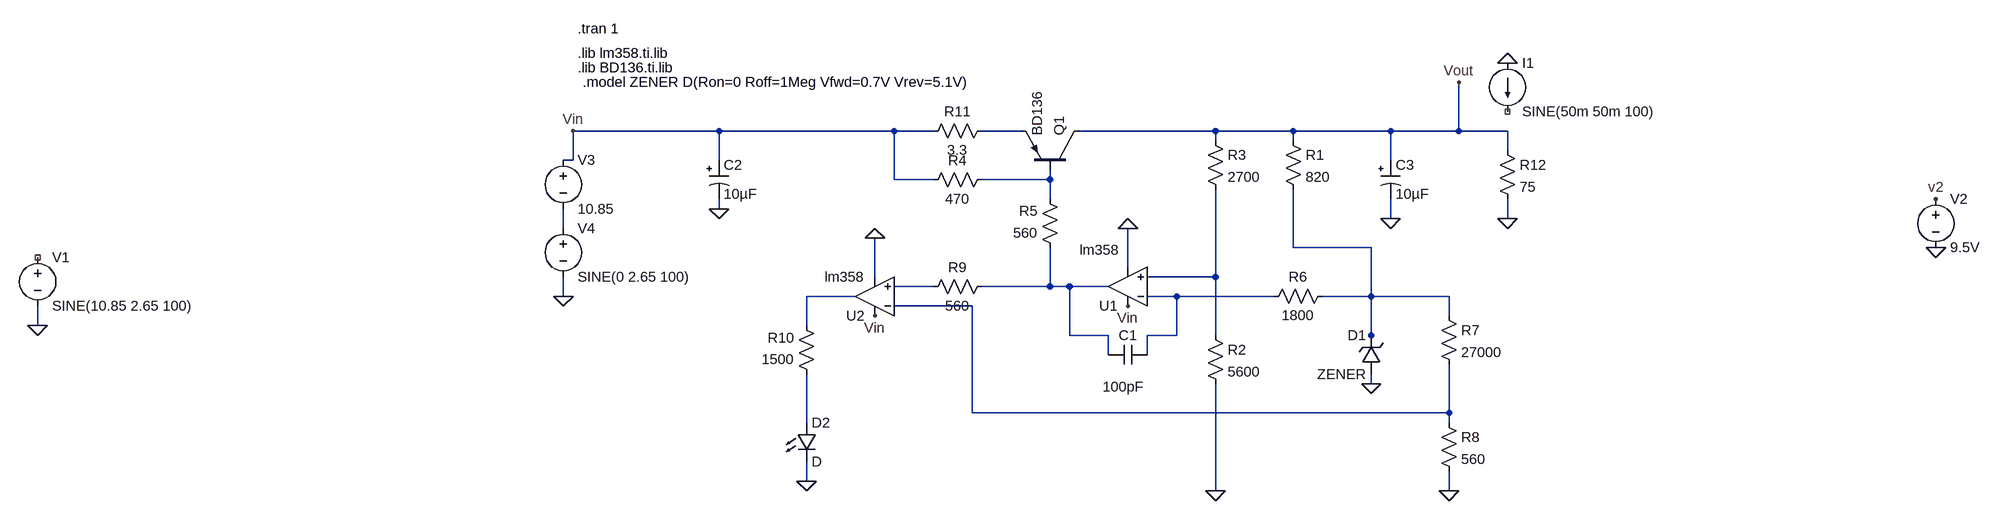
[diagram p0: schematic plab_1.asc]
plab_1.asc, the LTspice schematic file:
Version 4
SHEET 1 2036 896
WIRE -240 -208 -480 -208
WIRE 48 -208 -240 -208
WIRE 112 -208 48 -208
WIRE 256 -208 192 -208
WIRE 576 -208 352 -208
WIRE 704 -208 576 -208
WIRE 864 -208 704 -208
WIRE 976 -208 976 -288
WIRE 976 -208 864 -208
WIRE 1056 -208 976 -208
WIRE 576 -192 576 -208
WIRE 704 -192 704 -208
WIRE 1056 -176 1056 -208
WIRE -480 -160 -480 -208
WIRE -480 -160 -496 -160
WIRE -240 -160 -240 -208
WIRE 864 -160 864 -208
WIRE 48 -128 48 -208
WIRE 112 -128 48 -128
WIRE 304 -128 304 -144
WIRE 304 -128 192 -128
WIRE 304 -96 304 -128
WIRE -240 -80 -240 -96
WIRE 864 -64 864 -96
WIRE 1056 -64 1056 -96
WIRE -496 -48 -496 -80
WIRE 704 -16 704 -112
WIRE 832 -16 704 -16
WIRE 432 16 432 -48
WIRE 16 32 16 -32
WIRE 576 32 576 -112
WIRE 576 32 464 32
WIRE 112 48 48 48
WIRE 304 48 304 -16
WIRE 304 48 192 48
WIRE 336 48 304 48
WIRE 400 48 336 48
WIRE -496 64 -496 32
WIRE -16 64 -96 64
WIRE 512 64 464 64
WIRE 672 64 512 64
WIRE 832 64 832 -16
WIRE 832 64 752 64
WIRE 960 64 832 64
WIRE 176 80 48 80
WIRE 960 96 960 64
WIRE -1360 112 -1360 80
WIRE -96 112 -96 64
WIRE 336 128 336 48
WIRE 400 128 336 128
WIRE 512 128 512 64
WIRE 512 128 464 128
WIRE 576 128 576 32
WIRE 832 128 832 64
WIRE 832 144 832 128
WIRE 400 160 400 128
WIRE 464 160 464 128
WIRE 832 208 832 192
WIRE 176 256 176 80
WIRE 960 256 960 176
WIRE 960 256 176 256
WIRE -96 272 -96 192
WIRE 960 272 960 256
WIRE -96 368 -96 336
WIRE 576 384 576 208
WIRE 960 384 960 352
FLAG 1056 -64 0
FLAG 576 384 0
FLAG 960 384 0
FLAG -96 368 0
FLAG -240 -80 0
FLAG 832 208 0
FLAG 864 -64 0
FLAG 976 -288 Vout
FLAG -480 -208 Vin
FLAG -1360 112 0
FLAG 16 -32 0
FLAG 432 -48 0
FLAG 1760 -16 0
FLAG 1056 -320 0
FLAG 1760 -96 v2
FLAG 16 96 Vin
FLAG 432 80 Vin
FLAG -496 64 0
SYMBOL OpAmps\\opamp2 432 112 R180
WINDOW 3 13 124 Left 2
SYMATTR Value lm358
SYMATTR InstName U1
SYMBOL OpAmps\\opamp2 16 128 R180
SYMATTR InstName U2
SYMATTR Value lm358
SYMBOL pnp 352 -144 M270
SYMATTR InstName Q1
SYMATTR Value BD136
SYMBOL res 688 -208 R0
SYMATTR InstName R1
SYMATTR Value 820
SYMBOL res 560 112 R0
SYMATTR InstName R2
SYMATTR Value 5600
SYMBOL res 560 -208 R0
SYMATTR InstName R3
SYMATTR Value 2700
SYMBOL res 208 -144 R90
WINDOW 0 0 56 VBottom 2
WINDOW 3 32 56 VTop 2
SYMATTR InstName R4
SYMATTR Value 470
SYMBOL res 320 0 R180
WINDOW 0 36 76 Left 2
WINDOW 3 36 40 Left 2
SYMATTR InstName R5
SYMATTR Value 560
SYMBOL res 656 80 R270
WINDOW 0 32 56 VTop 2
WINDOW 3 0 56 VBottom 2
SYMATTR InstName R6
SYMATTR Value 1800
SYMBOL res 944 80 R0
SYMATTR InstName R7
SYMATTR Value 27000
SYMBOL res 944 256 R0
SYMATTR InstName R8
SYMATTR Value 560
SYMBOL res 208 32 R90
WINDOW 0 0 56 VBottom 2
WINDOW 3 32 56 VTop 2
SYMATTR InstName R9
SYMATTR Value 560
SYMBOL res -80 208 R180
WINDOW 0 36 76 Left 2
WINDOW 3 36 40 Left 2
SYMATTR InstName R10
SYMATTR Value 1500
SYMBOL res 208 -224 R90
WINDOW 0 0 56 VBottom 2
WINDOW 3 32 56 VTop 2
SYMATTR InstName R11
SYMATTR Value 3.3
SYMBOL res 1040 -192 R0
SYMATTR InstName R12
SYMATTR Value 75
SYMBOL cap 464 144 R90
WINDOW 0 0 32 VBottom 2
WINDOW 3 53 39 VTop 2
SYMATTR InstName C1
SYMATTR Value 100pF
SYMBOL LED -112 272 R0
SYMATTR InstName D2
SYMBOL polcap -256 -160 R0
SYMATTR InstName C2
SYMATTR Value 10µF
SYMBOL polcap 848 -160 R0
SYMATTR InstName C3
SYMATTR Value 10µF
SYMBOL voltage -1360 -16 R0
WINDOW 123 0 0 Left 0
WINDOW 39 0 0 Left 0
SYMATTR InstName V1
SYMATTR Value SINE(10.85 2.65 100)
SYMBOL zener 848 192 R180
WINDOW 0 24 64 Left 2
WINDOW 3 24 0 Left 2
SYMATTR InstName D1
SYMATTR Value ZENER
SYMBOL voltage 1760 -112 R0
WINDOW 123 0 0 Left 0
WINDOW 39 0 0 Left 0
SYMATTR InstName V2
SYMATTR Value 9.5V
SYMBOL current 1056 -320 R0
WINDOW 123 0 0 Left 0
WINDOW 39 0 0 Left 0
SYMATTR InstName I1
SYMATTR Value SINE(50m 50m 100)
SYMBOL voltage -496 -176 R0
WINDOW 123 0 0 Left 0
WINDOW 39 0 0 Left 0
SYMATTR InstName V3
SYMATTR Value 10.85
SYMBOL voltage -496 -64 R0
WINDOW 123 0 0 Left 0
WINDOW 39 0 0 Left 0
SYMATTR InstName V4
SYMATTR Value SINE(0 2.65 100)
TEXT -472 -336 Left 2 !.lib lm358.ti.lib
TEXT -472 -312 Left 2 !.lib BD136.ti.lib
TEXT -472 -376 Left 2 !.tran 1
TEXT -464 -288 Left 2 !.model ZENER D(Ron=0 Roff=1Meg Vfwd=0.7V Vrev=5.1V)

The netlist it stands for:
* plab_1.asc
XU1 N005 N009 Vin 0 N007 lm358  ; pins In+ In- V+ V- OUT
XU2 N006 N010 Vin 0 N008 lm358  ; pins In+ In- V+ V- OUT
Q1 Vout N002 N001 0 BD136
R1 Vout N004 820
R2 N005 0 5600
R3 Vout N005 2700
R4 N002 Vin 470
R5 N007 N002 560
R6 N009 N004 1800
R7 N004 N010 27000
R8 N010 0 560
R9 N007 N006 560
R10 N011 N008 1500
R11 N001 Vin 3.3
R12 Vout 0 75
C1 N009 N007 100pF
D2 N011 0 D
C2 Vin 0 10µF
C3 Vout 0 10µF
V1 NC_01 0 SINE(10.85 2.65 100)
D1 0 N004 ZENER
V2 v2 0 9.5V
I1 0 NC_02 SINE(50m 50m 100)
V3 Vin N003 10.85
V4 N003 0 SINE(0 2.65 100)
.model D D
.lib standard.dio
.model NPN NPN
.model PNP PNP
.lib standard.bjt
.lib lm358.ti.lib
.lib BD136.ti.lib
.tran 1
.model ZENER D(Ron=0 Roff=1Meg Vfwd=0.7V Vrev=5.1V)
.backanno
.end